# EAGLE design cassowarii-controller (EAGLE 9.2.2)
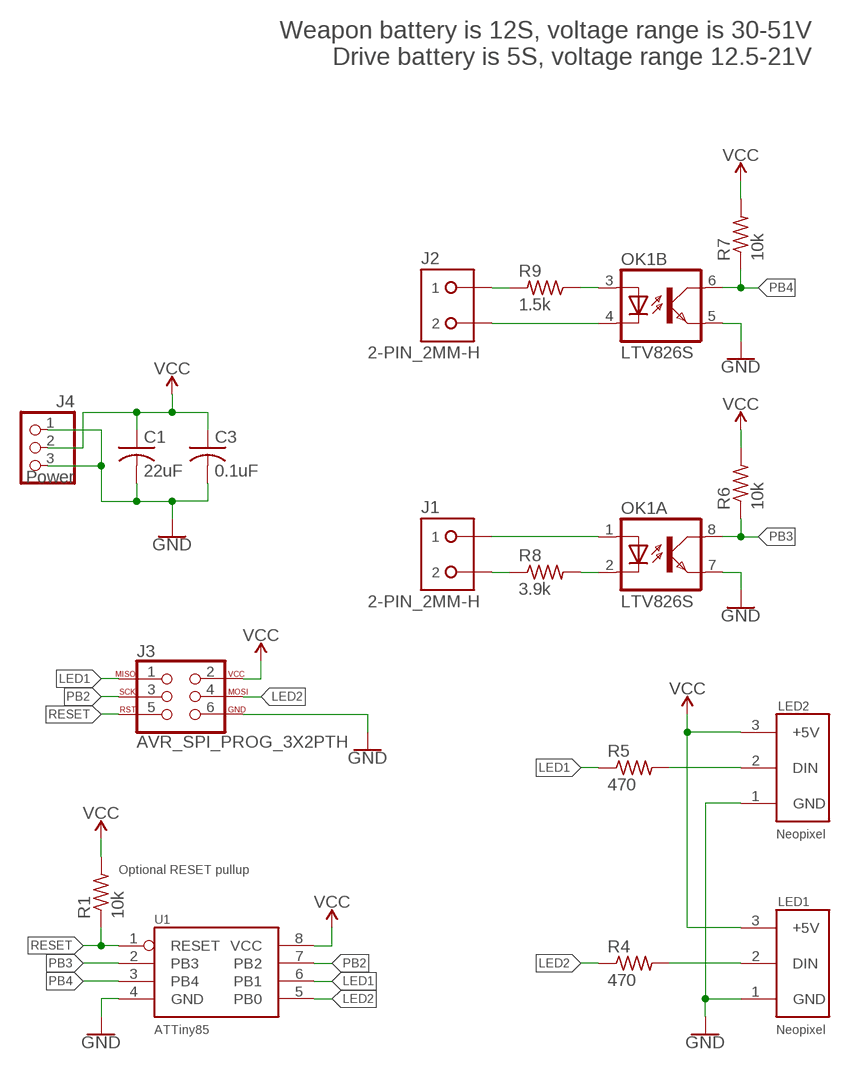
[diagram p0: schematic, sheet 1]

## Parts
C1  22uF  C-USC0805  [C0805]
C3  0.1uF  C-USC0805  [C0805]
J1  2-PIN_2MM-H  [2MM-2-H]
J2  2-PIN_2MM-H  [2MM-2-H]
J3  AVR_SPI_PROG_3X2PTH  [2X3]
J4  Power  PINHD-1X3  [1X03]
LED1  Neopixel  NEOPIXEL2MM_MOLEX  [2MM-3-H]
LED2  Neopixel  NEOPIXEL2MM_MOLEX  [2MM-3-H]
OK1  LTV826S  [DIL8-SMD]
R1  10k  R-US_R0805  [R0805]
R4  470  R-US_R0805  [R0805]
R5  470  R-US_R0805  [R0805]
R6  10k  R-US_R0805  [R0805]
R7  10k  R-US_R0805  [R0805]
R8  3.9k  R-US_0207/2V  [0207/2V]
R9  1.5k  R-US_0207/2V  [0207/2V]
U1  ATTiny85  ATTINY85SOIC8  [SOIC8]

## Nets
GND: C1.2 C3.2 J3.6 J4.1 J4.3 LED1.1(GND) LED2.1(GND) OK1.5(B:EMIT) OK1.7(A:EMIT) U1.4(GND)
LED1: J3.1 R5.1 U1.6(PB1)
LED2: J3.4 R4.1 U1.5(PB0)
N$1: LED1.2(DIN) R4.2
N$2: LED2.2(DIN) R5.2
N$3: J2.1 R9.2
N$4: J1.2 R8.1
N$5: OK1.3(B:A) R9.1
N$6: J2.2 OK1.4(B:C)
N$7: J1.1 OK1.1(A:A)
N$8: OK1.2(A:C) R8.2
PB2: J3.3 U1.7(PB2)
PB3: OK1.8(A:COL) R6.1 U1.2(PB3)
PB4: OK1.6(B:COL) R7.1 U1.3(PB4)
RESET: J3.5 R1.1 U1.1(RESET)
VCC: C1.1 C3.1 J3.2 J4.2 LED1.3(+5V) LED2.3(+5V) R1.2 R6.2 R7.2 U1.8(VCC)

## Notes on the sheet
- Weapon battery is 12S, voltage range is 30-51V
  Drive battery is 5S, voltage range 12.5-21V
- Optional RESET pullup

## Library data of the parts
C1 C3 = resistor:C-US: CAPACITOR, American symbol
J1 J2 = RoboJackets-Connectors:2-PIN_2MM-*; PINS: 2; PIN_PITCH: 2.0 mm
J3 = SparkFun-Connectors:AVR_SPI_PROG_3X2: AVR ISP 6 Pin This is the reduced ISP connector for AVR programming. Common on Arduino. This footprint will take up less PCB space and can be used with a 10-pin to 6-pin adapter such as SKU: BOB-08508 **Special note about "TEST_POINT" package. The stop mask is on the top side, so if you want your programming test points to be on the bottom of your board, make sure to place this package on the bottom side of the board. This also ensure that the orientation to program from the bottom side will be correct. SparkFun Products: SparkFun ISP Pogo Adapter <https://www.sparkfun.com/products/11591> - NS Tiny AVR Programmer <https://www.sparkfun.com/products/11801> -PTH
J4 = pinhead:PINHD-1X3: PIN HEADER
LED1 LED2 = JoshCustom:NEOPIXEL: Connector for a Neopixel strip
OK1 = optocoupler:LTV826: OPTO COUPLER Source: LITEON, LTV816.pdf; OC_FARNELL: unknown; OC_NEWARK: unknown
R1 R4-R9 = resistor:R-US_: RESISTOR, American symbol
U1 = JoshCustom:ATTINY85: ATTiny85 microcontroller

## Board
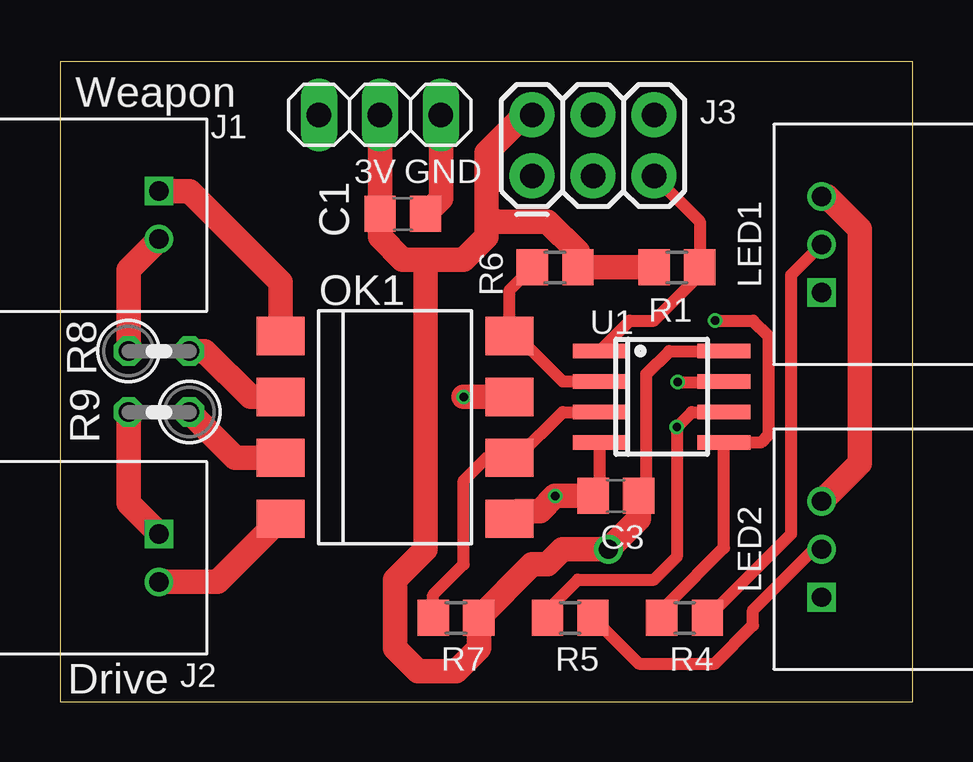
[diagram p1: board, top side]
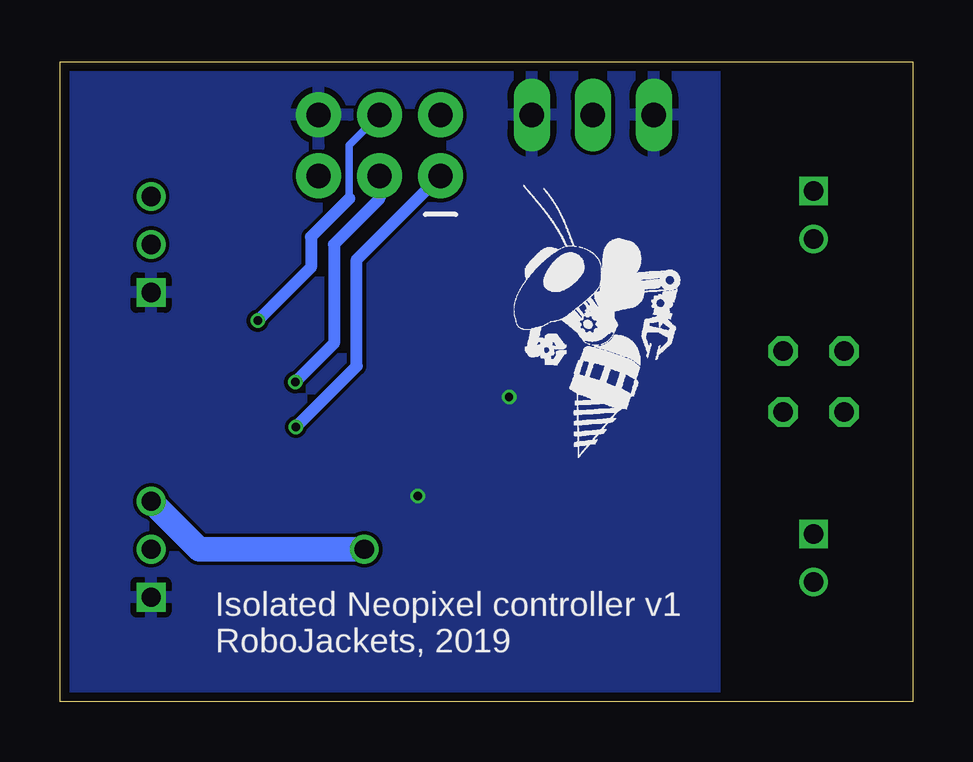
[diagram p2: board, bottom side, seen from below]

Size 35.55 x 26.66 mm. Coordinates in mm from the lower left corner, seen from the top.
Outline: 0,0 35.55,0 35.55,26.66 0,26.66 0,0
Copper layers (1*16): Top 0.035559375mm / dielectric 1.6mm / Bottom 0.035559375mm
Design rules "oshpark2layer": minimum track width 6mil, minimum drill 10mil, track to track 6mil, track to pad 6mil, pad to pad 6mil, via to via 6mil, smd to smd 6mil, copper to edge 15mil, drill to drill 6mil, minimum pad ring 5mil, minimum via ring 5mil, stop-mask expansion 2.5mil, vias tented up to drill 0mil, thermal gap 10mil

### Footprints (pad centres in the part's own frame; a part is rotated, then mirrored left to right if it is on the bottom)
C0805 = smd 1.3 x 1.5: 1 -0.95,0; 2 0.95,0
2MM-2-H = drill 0.8 square: 1 0,0 | drill 0.8: 2 2,0
2X3 = drill 1.016 pad 1.88: 1 0,0; 2 0,2.54; 3 2.54,0; 4 2.54,2.54; 5 5.08,0; 6 5.08,2.54
1X03 = drill 1.016 long: 1 -2.54,0; 2 0,0; 3 2.54,0
2MM-3-H = drill 0.8 square: 1 -2,0 | drill 0.8: 2 0,0; 3 2,0
DIL8-SMD = smd 1.6 x 2: 1 -3.81,-4.77; 2 -1.27,-4.77; 3 1.27,-4.77; 4 3.81,-4.77; 5 3.81,4.77; 6 1.27,4.77; 7 -1.27,4.77; 8 -3.81,4.77
R0805 = smd 1.3 x 1.5: 1 -0.95,0; 2 0.95,0
0207/2V = drill 0.813 octagon: 1 -1.27,0; 2 1.27,0
SOIC8 = smd 0.6 x 2.2: 1 -1.905,-2.6; 2 -0.635,-2.6; 3 0.635,-2.6; 4 1.905,-2.6; 5 1.905,2.6; 6 0.635,2.6; 7 -0.635,2.6; 8 -1.905,2.6

### Placement (x,y rotation side)
C1  14.29,20.32 0 top
C3  23.18,8.57 180 top
J1  4.13,21.27 270 top
J2  4.13,6.99 270 top
J3  19.68,21.91 0 top
J4  13.34,24.45 180 top
LED1  31.75,19.05 90 top
LED2  31.75,6.35 90 top
OK1  13.97,11.43 270 top
R1  25.72,18.1 180 top
R4  26.04,3.49 0 top
R5  21.27,3.49 0 top
R6  20.64,18.1 0 top
R7  16.51,3.49 0 top
R8  4.13,14.61 0 top
R9  4.13,12.06 180 top
U1  25.08,12.7 270 top
U$1  [ROBOBUZZ_0.6X]  13.97,10.16 0 bottom

### Tracks (layer width: path | path; a pad name or v marks a point on that pad's centre or on a via)
GND  (via drill 0.35)
  Top 0.508: U1.4 22.48,8.83 C3.2
  Top 1.016: J4.1 15.88,20.96 C1.2 | OK1.7 v16.83,12.7 | OK1.5 19.06,7.94 20,7.94 v20.64,8.57 C3.2
  pour Bottom: 35.56,26.67 35.56,0 8.26,0 8.26,26.67
LED1  (via drill 0.35)
  Top 0.508: R5.1 20.32,3.81 21.59,5.08 24.77,5.08 25.72,6.03 v25.72,11.44 26.34,12.06 U1.6
  Bottom 0.508: v25.72,11.44 23.18,13.98 23.18,18.41 J3.1
LED2  (via drill 0.35)
  Top 0.508: R4.1 25.4,3.81 25.4,4.13 27.68,6.41 U1.5 29.21,10.79 29.53,11.11 29.53,15.24 28.89,15.88 v27.3,15.88
  Bottom 0.305: J3.4 23.5,23.18 23.5,20.95
  Bottom 0.508: 23.5,20.95 25.08,19.37 25.08,18.1 v27.3,15.88
N$1
  Top 0.508: R4.2 30.48,6.99 30.48,17.78 LED1.2
N$2
  Top 0.508: R5.2 24.13,1.59 27.3,1.59 28.89,3.17 28.89,3.81 31.43,6.35 LED2.2
N$3
  Top 1.016: R9.2 2.86,8.26 J2.1
N$4
  Top 1.016: R8.1 2.86,18 J1.2
N$5
  Top 1.016: R9.1 7.3,10.16 OK1.3
N$6
  Top 1.016: J2.2 6.57,4.99 OK1.4
N$7
  Top 1.016: OK1.1 9.2,17.47 5.4,21.27 J1.1
N$8
  Top 1.016: R8.2 6.03,14.61 7.94,12.7 OK1.2
PB2  (via drill 0.35)
  Top 0.508: v25.74,13.31 27.66,13.31 U1.7
  Bottom 0.508: v25.74,13.31 24.13,14.92 24.13,19.05 22.23,20.95 J3.3
PB3
  Top 0.508: U1.2 20.96,13.34 19.06,15.24 OK1.8 18.74,17.15 R6.1
PB4
  Top 0.508: U1.3 20.96,12.06 19.06,10.16 OK1.6 17.78,10.16 16.83,9.21 16.83,5.71 15.56,4.45 R7.1
RESET
  Top 0.508: U1.1 23.75,15.88 24.77,15.88 26.67,17.78 R1.1 26.67,20 J3.5
VCC  (via drill 0.8)
  Top 0.508: C3.1 24.45,8.89 24.45,13.65 25.4,14.61 U1.8
  Top 1.016: J4.2 C1.1 13.34,19.36 14.29,18.41 15.24,18.41 | 15.24,18.41 16.83,18.41 17.78,19.37 17.78,20.32 | 17.78,20.32 17.78,22.86 19.37,24.45 J3.2 | 17.78,20.32 18.1,20 20.32,20 21.59,18.73 R6.2 R1.2 | LED2.3 33.34,9.94 33.34,19.68 31.97,21.05 LED1.3 | 15.24,18.41 15.24,6.35 13.97,5.08 13.97,2.22 14.92,1.27 16.51,1.27 17.46,2.22 R7.2 19.68,5.71 20.32,5.71 20.95,6.35 v22.86,6.35 24.13,7.62 C3.1
  Bottom 1.016: LED2.3 29.75,6.35 v22.86,6.35

### Text on the board
tPlace: Weapon | 3V | GND | Drive
bPlace: Isolated Neopixel controller v1 / RoboJackets, 2019